# Altium schematic sheet DAISY_CHAINING.SchDoc
size A4
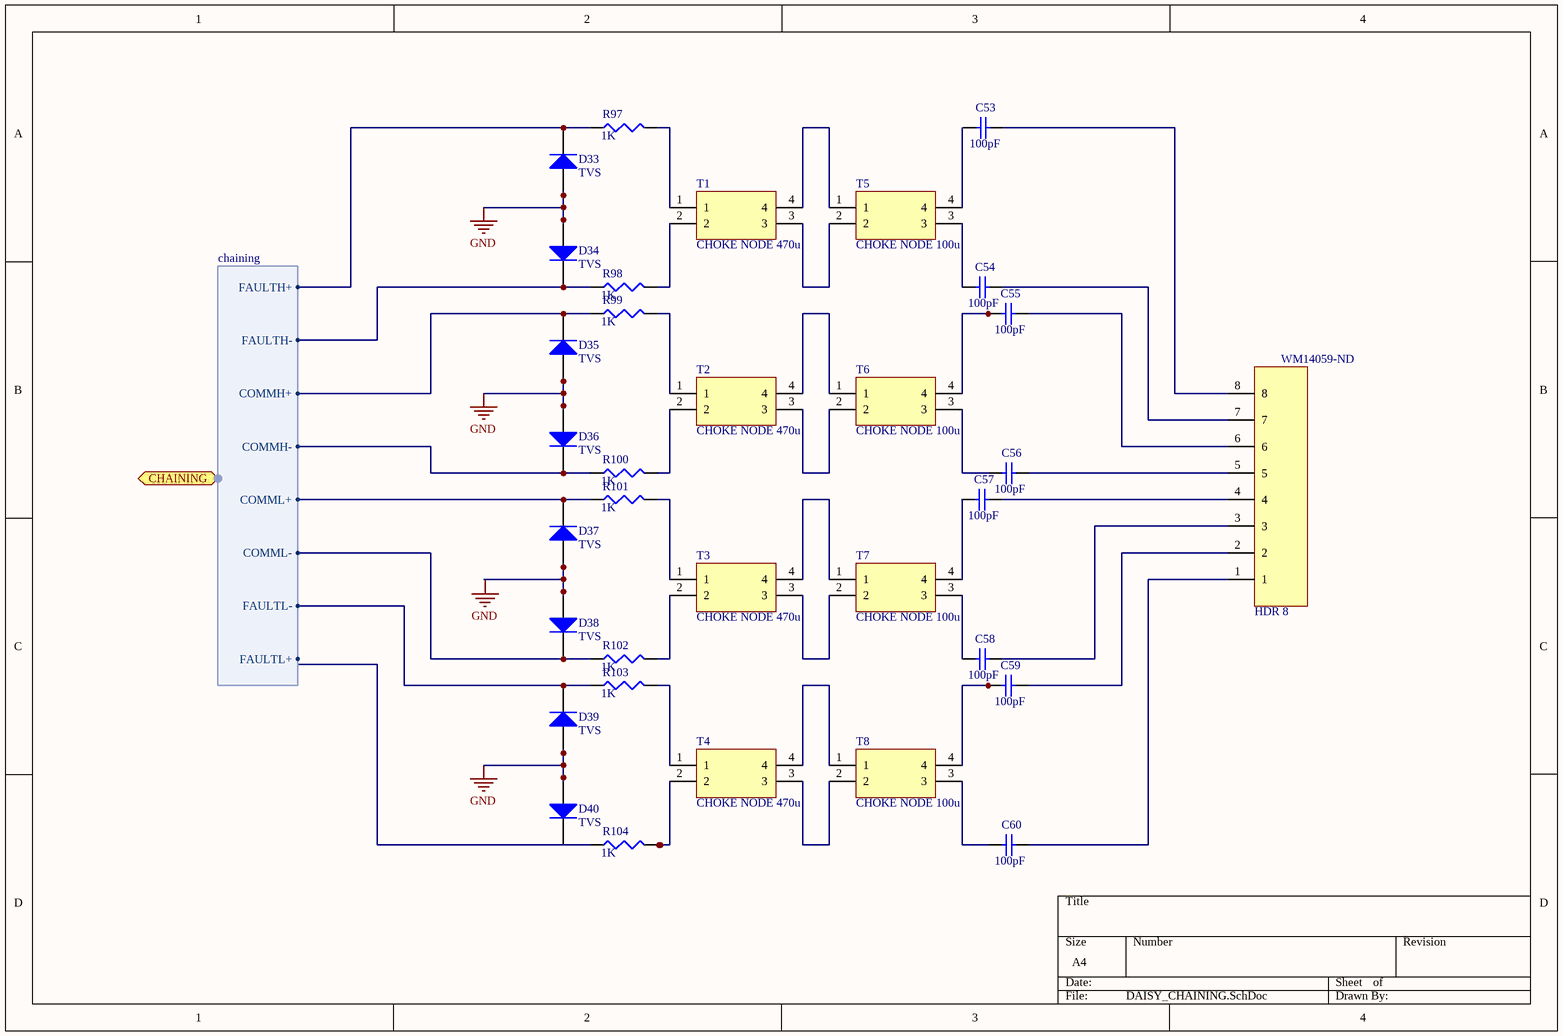
[diagram p0: DAISY_CHAINING.SchDoc]

## Parts
?  HDR 8  Supplier Part Number 1: WM14059-ND  [COMM HDR]
C53  value 100pF  [C1206]  (hidden comment: Cap Semi)
C54  value 100pF  [C1206]  (hidden comment: Cap Semi)
C55  value 100pF  [C1206]  (hidden comment: Cap Semi)
C56  value 100pF  [C1206]  (hidden comment: Cap Semi)
C57  value 100pF  [C1206]  (hidden comment: Cap Semi)
C58  value 100pF  [C1206]  (hidden comment: Cap Semi)
C59  value 100pF  [C1206]  (hidden comment: Cap Semi)
C60  value 100pF  [C1206]  (hidden comment: Cap Semi)
D33  TVS  [TVS DIODE]
D34  TVS  [TVS DIODE]
D35  TVS  [TVS DIODE]
D36  TVS  [TVS DIODE]
D37  TVS  [TVS DIODE]
D38  TVS  [TVS DIODE]
D39  TVS  [TVS DIODE]
D40  TVS  [TVS DIODE]
R97  value 1K  [J1-0603]  (hidden comment: Res3)
R98  value 1K  [J1-0603]  (hidden comment: Res3)
R99  value 1K  [J1-0603]  (hidden comment: Res3)
R100  value 1K  [J1-0603]  (hidden comment: Res3)
R101  value 1K  [J1-0603]  (hidden comment: Res3)
R102  value 1K  [J1-0603]  (hidden comment: Res3)
R103  value 1K  [J1-0603]  (hidden comment: Res3)
R104  value 1K  [J1-0603]  (hidden comment: Res3)
T1  CHOKE NODE 470u  [732-1686-1-ND]
T2  CHOKE NODE 470u  [732-1686-1-ND]
T3  CHOKE NODE 470u  [732-1686-1-ND]
T4  CHOKE NODE 470u  [732-1686-1-ND]
T5  CHOKE NODE 100u  [445-3959-1-ND]
T6  CHOKE NODE 100u  [445-3959-1-ND]
T7  CHOKE NODE 100u  [445-3959-1-ND]
T8  CHOKE NODE 100u  [445-3959-1-ND]

## Ports
CHAINING (harness chaining)

## Harnesses
chaining: FAULTH+, FAULTH-, COMMH+, COMMH-, COMML-, COMML+, FAULTL-, FAULTL+

## Nets
GND: D33.1(A) D34.1(A) D35.1(A) D36.1(A) D39.1(A) D40.1(A)
Net?_1: ?.1 C60.2
Net?_2: ?.2 C59.2
Net?_3: ?.3 C58.2
Net?_4: ?.4 C57.2
Net?_5: ?.5 C56.2
Net?_6: ?.6 C55.2
Net?_7: ?.7 C54.2
Net?_8: ?.8 C53.2
NetC54_1: C54.1 T5.3
NetC55_1: C55.1 T6.4
NetC56_1: C56.1 T6.3
NetC57_1: C57.1 T7.4
NetC58_1: C58.1 T7.3
NetC59_1: C59.1 T8.4
NetC60_1: C60.1 T8.3
NetD33_2: D33.2(K) R97.1 ; port CHAINING.FAULTH+
NetD34_2: D34.2(K) R98.1 ; port CHAINING.FAULTH-
NetD35_2: D35.2(K) R99.1 ; port CHAINING.COMMH+
NetD36_2: D36.2(K) R100.1 ; port CHAINING.COMMH-
NetD37_1: D37.1(A) D38.1(A)
NetD37_2: D37.2(K) R101.1 ; port CHAINING.COMML+
NetD38_2: D38.2(K) R102.1 ; port CHAINING.COMML-
NetD39_2: D39.2(K) R103.1 ; port CHAINING.FAULTL-
NetD40_2: D40.2(K) R104.1
NetR97_2: R97.2 T1.1
NetR98_2: R98.2 T1.2
NetR99_2: R99.2 T2.1
NetR100_2: R100.2 T2.2
NetR101_2: R101.2 T3.1
NetR102_2: R102.2 T3.2
NetR103_2: R103.2 T4.1
NetR104_2: R104.2 T4.2
NetT1_3: T1.3 T5.2
NetT1_4: T1.4 T5.1
NetT2_3: T2.3 T6.2
NetT2_4: T2.4 T6.1
NetT3_3: T3.3 T7.2
NetT3_4: T3.4 T7.1
NetT4_3: T4.3 T8.2
NetT4_4: T4.4 T8.1

Not connected (* = marked no-connect by the designer): C53 1; T5 4

## Notes on the sheet
- Labels drawn without touching a wire or pin: GND

## Library data of the parts
? = HDR 8: Manufacturer: Molex; Manufacturer Part Number: 0705510038; Contact Resistance: 15mR; Number of Positions: 4; Connector Type: Male Pin; Pitch: 2.54mm; Supplier 1: Digi-Key; Stock 1: 677; Pricing 1: 1=1.84, 10=1.666, 100=1.428, 500=1.19, 1000=1.02, 5000=0.9044, 10000=0.884 (USD); Mount: Through Hole; Contact Plating: Gold; Contact Material: Copper Alloy; Housing Colour: Black; Housing Material: Polyester; Colour: Black; Min Operating Temperature: -40°C; Max Operating Temperature: 105°C; Package Quantity: 1520; Number of Rows: 1; Packaging: Rail/Tube; Termination: Solder; Number of Contacts: 4; Orientation: Right Angle; Fastening Type: Latch; Depth: 13.59mm; Contact Mating Length: 0.24inch
C53-C60 = Cap Semi: Capacitor (Semiconductor SIM Model); Published: 8-Jun-2000; LatestRevisionDate: 29-May-2009; LatestRevisionNote: IPC-7351 Footprint Added.; PackageReference: C1206; Publisher: Altium Limited; PackageDescription: Chip Capacitor
D33-D40 = DIODE: Default Diode; Published: 8-Jun-2000; LatestRevisionDate: 17-Jul-2002; LatestRevisionNote: Re-released for DXP Platform.; PackageVersion: Sep-1996; PackageReference: SMC; Publisher: Altium Limited; PackageDescription: DO-214-AB/SMC; 2 C-Bend Leads; Body 7.9 x 5.9 mm, inc. leads (LxW); Code_JEDEC: DO-214-AB
R97-R104 = Res3: Resistor; Published: 8-Jun-2000; LatestRevisionDate: 29-May-2009; LatestRevisionNote: IPC-7351 Footprint Added.; PackageReference: J1-0603; Publisher: Altium Limited; PackageDescription: Chip Resistor